# Altium schematic sheet GPS.SchDoc: =title
size A3; DocumentNumber: 8; SheetNumber: 8; SheetTotal: 9
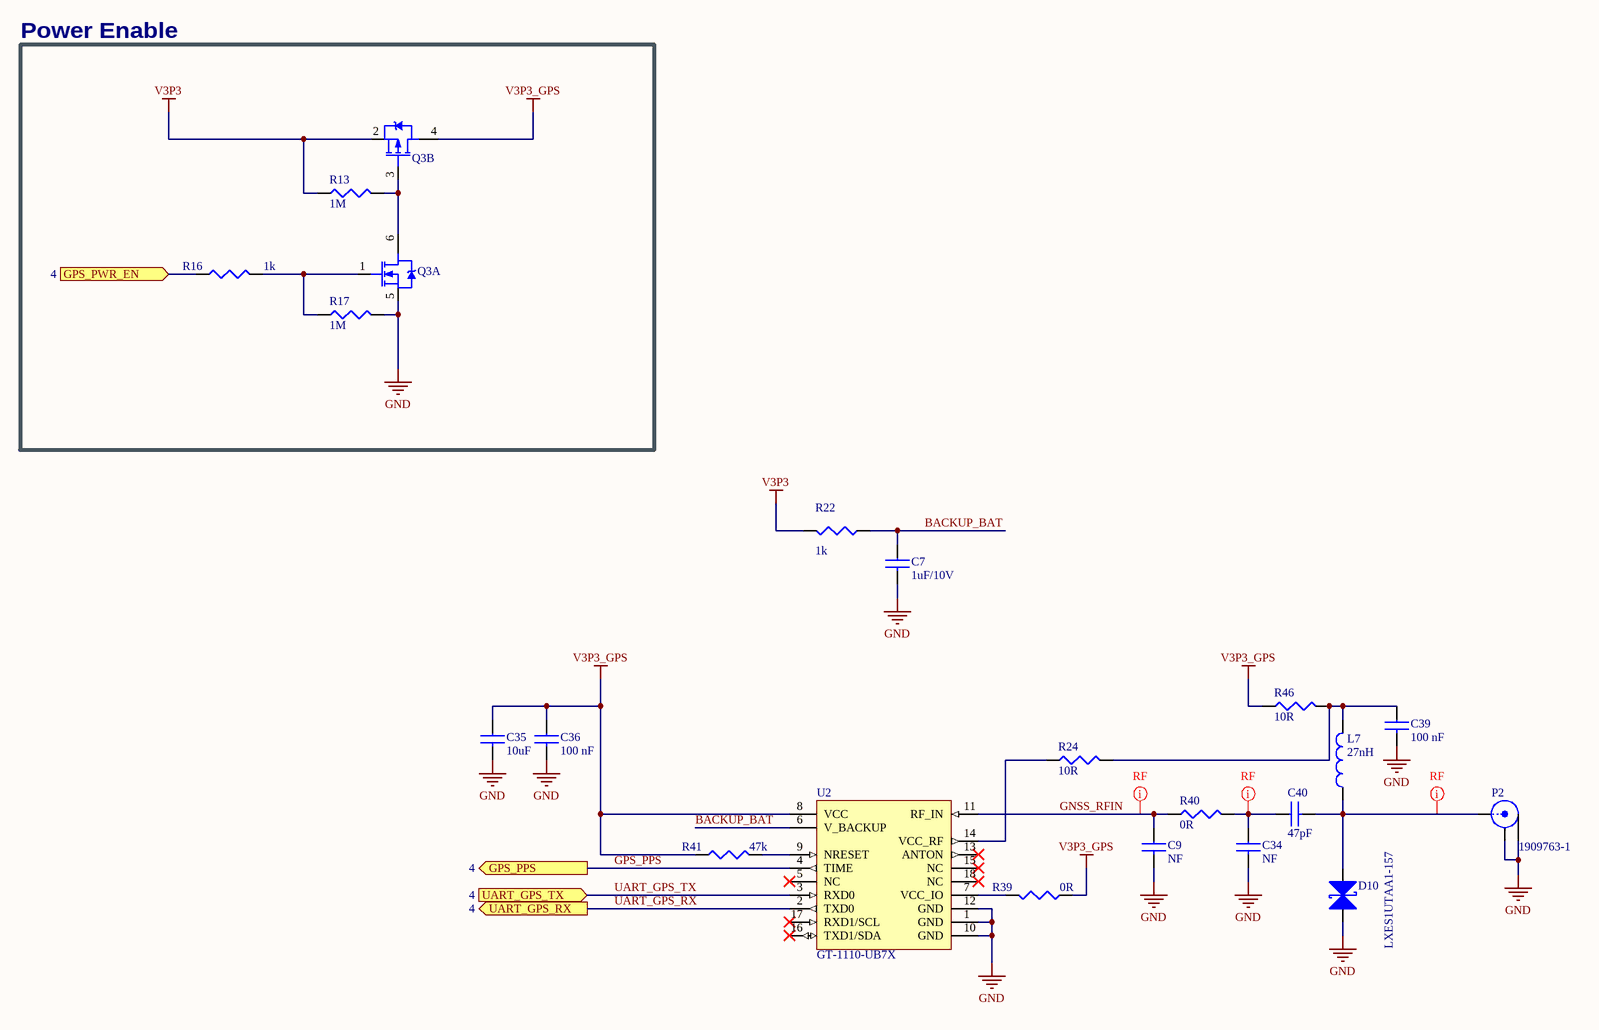
[diagram p0: GPS.SchDoc]

## Parts
C7  1uF/10V  [C0402]
C9  NF  [C0402]
C34  NF  [C0402]
C35  10uF  [C0805]
C36  100 nF  [C0402]
C39  100 nF  [C0402]
C40  47pF  [C0402]
D10  LXES1UTAA1-157  [T0402]
L7  27nH  [L0402]
P2  1909763-1  [CON_U.FL]
Q3  DMC2700UDM-7  [SOT23-6]  (value not drawn)  (parts A,B of 2)
R13  1M  [R0402]
R16  1k  [R0603]
R17  1M  [R0402]
R22  1k  [R0603]
R24  10R  [R0402]
R39  0R  [R0402]
R40  0R  [R0402]
R41  47k  [R0402]
R46  10R  [R0402]
U2  GT-1110-UB7X  [SIM28ML]

## Blocks framed on the sheet
Power Enable: Q3 R13 R16 R17

## Ports
GPS_PPS (out, see 4), GPS_PWR_EN (in, see 4), UART_GPS_RX (out, see 4), UART_GPS_TX (in, see 4)

## Nets
GND: C7.2 C9.2 C34.2 C35.2 C36.2 C39.2 D10.1(K) P2.2(Y) P2.3(GND) Q3.5(S) R17.1 U2.1(GND) U2.10(GND) U2.12(GND)
V3P3: Q3.2(S) R13.2 R22.2
V3P3_GPS: C35.1 C36.1 Q3.4(D) R39.1 R41.1 R46.1 U2.8(VCC)
BACKUP_BAT: C7.1 R22.1 U2.6(V_BACKUP)
GNSS_RFIN: C9.1 R40.1 U2.11(RF_IN)
GPS_PPS: U2.4(TIME) ; port GPS_PPS
GPS_PWR_EN: R16.2 ; port GPS_PWR_EN
UART_GPS_RX: U2.2(TXD0) ; port UART_GPS_RX
UART_GPS_TX: U2.3(RXD0) ; port UART_GPS_TX
NetC34_1: C34.1 C40.1 R40.2
NetC39_1: C39.1 L7.2 R24.2 R46.2
NetC40_2: C40.2 D10.2(A) L7.1 P2.1(X)
NetQ3_1: Q3.1(G) R16.1 R17.2
NetQ3_3: Q3.3(G) Q3.6(D) R13.1
NetR24_1: R24.1 U2.14(VCC_RF)
NetR39_2: R39.2 U2.7(VCC_IO)
NetR41_2: R41.2 U2.9(NRESET)

Not connected (* = marked no-connect by the designer): U2 5(NC)* 13(ANTON)* 15(NC)* 16(TXD1/SDA)* 17(RXD1/SCL)* 18(NC)*

## Layout directives
net class RF: GNSS_RFIN, NetC34_1, NetC40_2

## Notes on the sheet
- Company:
- CONFIDENTAL. Do not distribute.
- Title:
- Size:
- Date:
- A3
- Number:
- Time:
- Variant:
- Revision:
- Sheet
- of
- File:
- Engineer:

## Library data of the parts
C7 = C0402-1uF_10V: CAP, CERM, 1 uF, 10V, +/- 10%, X5R, 0402; CompType: Capacitor; Value: 1uF/10V; Category: Capacitors; Operating Temperature: -55°C ~ 85°C; Package / Case: 0402; RoHS: RoHS Compliant; Temperature Coefficient: X5R; Tolerance: 10%; Voltage - Rated: 10V; MountType: SMT; Technology: Ceramic
C9 C34 = C0402-1.8pF: CAP, CERM, 1.8pF, 50V, +/- 0.1pF, C0G/NP0, 0402; CompType: Capacitor; Category: Capacitors; Operating Temperature: -55°C ~ 125°C; Package / Case: 0402; RoHS: RoHS Compliant; Temperature Coefficient: C0G/NP0; Tolerance: +/- 0.1pF; Voltage - Rated: 50V; MountType: SMT; Technology: Ceramic; Value: NF
C35 = C0805-10uF_16V: CAP, CERM, 10uF, 16V, +/- 20%, X5R, 0805; Manufacturer Part Number: GRM21BR61C106KE15L; CompType: Capacitor; Value: 10uF; Category: Capacitors; Operating Temperature: -55°C ~ 85°C; Package / Case: 0805 (2012 Metric); RoHS: RoHS Compliant; Temperature Coefficient: X5R; Tolerance: 20%; Voltage - Rated: 16 V; MountType: SMT; Technology: Ceramic
C36 C39 = C0402-100nF_50V: CAP, CERM, 100 nF, 50V, +/- 10%, X7R, 0402; Manufacturer Part Number: GRM155R71H104KE14J; CompType: Capacitor; Value: 100 nF; Category: Capacitors; Operating Temperature: -55°C ~ 125°C; Package / Case: 0402; RoHS: RoHS Compliant; Temperature Coefficient: X7R; Tolerance: 10%; Voltage - Rated: 50 V; MountType: SMT; Technology: Ceramic
C40 = C0402-47pF: CAP, CERM, 47pF, 16V, +/- 5%, C0G/NP0, 0402; Manufacturer Part Number: 885012005029; CompType: Capacitor; Category: Capacitors; Operating Temperature: -55°C ~ 125°C; Package / Case: 0402; RoHS: RoHS Compliant; Temperature Coefficient: C0G/NP0; Tolerance: 5%; Voltage - Rated: 16 V; MountType: SMT; Technology: Ceramic; Value: 47pF
D10 = TVSBi_LXES15AAA1-153: TVS DIODE 15 V 0402; Manufacturer: Murata; Type: Zener; Bidirectional Channels: 1; Voltage - Reverse Standoff (Typ): 4V; Power Line Protection: No; Capacitance @ Frequency: 0.05pF @ 1MHz; Supplier 1: Mouser; Manufacturer Part Number: LXES1UTAA1-157; Stock 1: 40283; Pricing 1: 1=0.19, 10=0.105, 50=0.105, 100=0.073, 1000=0.054, 10000=0.042 (USD); Category: Circuit Protection; Family: TVS - Diodes; Series: -; Packaging: Tape & Reel (TR); Unidirectional Channels: -; Voltage - Breakdown (Min): -; Voltage - Clamping (Max) @ Ipp: -; Current - Peak Pulse (10/1000µs): -; Power - Peak Pulse: -; Applications: General Purpose; Operating Temperature: -40°C ~ 85°C (TA); Mounting Type: Surface Mount; Package / Case: 0402 (1005 Metric); Supplier Device Package: 1005; Supplier Part Number 1: 81-LXES15AAA1-153
L7 = LQW15AN27NJ00D: Inductor, Wirewound, 27 nH, 280mA , 520mOhm, SMD; Manufacturer: Murata; Core Material: Air,Ferrite; Tolerance: 5%; DC Resistance (DCR): 520mR; Q Factor: 25; Self Resonant Frequency: 3.5GHz; Shielding: Unshielded; Test Frequency: 100MHz; Supplier 1: Digi-Key; Supplier Part Number 1: 490-1151-1-ND; Manufacturer Part Number: LQW15AN27NJ00D; Stock 1: 111681; Pricing 1: 1=0,17000, 10=0,15500, 100=0,10350, 500=0,08626, 1000=0,07245, 2500=0,06210 (USD); RoHS: Yes; Mount: Surface Mount; Case/Package: 0402; Weight: 2.8E-05oz; Case Code (Metric): 1005; Case Code (Imperial): 0402; Min Operating Temperature: -55°C; Max Operating Temperature: 125°C; Inductance: 27nH; Max DC Current: 280mA; Packaging: Tape and Reel; Package Quantity: 10000; Current Rating: 280mA; Termination: SMD/SMT; Composition: Wirewound; DC Current: 280mA; Military Standard: Not; Length: 1mm; Height: 0.5mm; Width: 0.02inch; Depth: 0.6mm; Radiation Hardening: No; Lead Free: Lead Free; ComponentLink1URL: https://datasheet.ciiva.com/11799/0900766b8090d5c4-11799101.pdf?src-supplier=RSComponents; ComponentLink1Description: https://datasheet.ciiva.com/11799/0900766b8090d5c4-11799101.pdf?src-supplier=RSComponents; ComponentLink2URL: https://datasheet.ciiva.com/17247/l0075s0080lqw15a-00-17247719.pdf?src-supplier=Avnet+Europe; ComponentLink2Description: https://datasheet.ciiva.com/17247/l0075s0080lqw15a-00-17247719.pdf?src-supplier=Avnet+Europe; ComponentLink3URL: https://datasheet.ciiva.com/4977/product-4977130.pdf?src-supplier=Mouser; ComponentLink3Description: https://datasheet.ciiva.com/4977/product-4977130.pdf?src-supplier=Mouser; ComponentLink4URL: https://datasheet.ciiva.com/18088/getdatasheetpartid-55784-18088810.pdf?src-supplier=Verical; ComponentLink4Description: https://datasheet.ciiva.com/18088/getdatasheetpartid-55784-18088810.pdf?src-supplier=Verical; ComponentLink5URL: https://datasheet.ciiva.com/8507/l0075s0080lqw15a-00-8507612.pdf?src-supplier=Avnet; ComponentLink5Description: https://datasheet.ciiva.com/8507/l0075s0080lqw15a-00-8507612.pdf?src-supplier=Avnet; Value: 27nH
P2 = CON_U.FL: CONN UMCC JACK STR 50OHM SMD; Manufacturer: TE Connectivity AMP Connectors; Connector Style: Ultra Miniature Coaxial; Connector Type: Jack, Male Pin; Contact Termination: Solder; Frequency - Max: 6GHz; Includes: 1 pc - 1 Connector; Body Material: Copper Alloy; Body Finish: Gold; Dielectric Material: Liquid Crystal Polymer (LCP); Voltage Rating: 60V; Mating Cycles: 30; Insertion Loss: 0.24dB; .Checked PCB: OK M; Supplier 1: Digi-Key; Manufacturer Part Number: 1909763-1; RoHS: RoHS Compliant; Category: Connectors, Interconnects; Stock 1: 68653; Pricing 1: 1=0.54, 10=0.508, 25=0.4572, 50=0.4066, 100=0.3896, 250=0.35576, 500=0.3388, 1000=0.27951, 2500=0.2541 (USD); Packaging: Cut Tape (CT); Part Status: Active; Shield Termination: Solder; Impedance: 50 Ohm; Mounting Type: Surface Mount; Mounting Feature: -; Cable Group: -; Fastening Type: Snap-On; Features: -; Housing Color: Ivory; Ingress Protection: -; Center Contact Plating: Gold; Operating Temperature: -40°C ~ 90°C; Center Contact Material: Copper Alloy; ComponentLink1URL: http://www.te.com/commerce/DocumentDelivery/DDEController?Action=srchrtrv&DocNm=1909763&DocType=Customer+Drawing&DocLang=English; ComponentLink1Description: http://www.te.com/commerce/DocumentDelivery/DDEController?Action=srchrtrv&DocNm=1909763&DocType=Customer+Drawing&DocLang=English; Supplier Part Number 1: A118077CT-ND; .Checked SCH: OK M
Q3 = Diodes=DMC2700UDM-7: Trans MOSFET N/P-CH 20V 1.34A/1.14A Automotive 6-Pin SOT-26 T/R; Manufacturer: Diodes; Turn-On Delay Time: 5.1ns; Gate to Source Voltage (Vgs): 6V; Rds On Max: 400mR; Input Capacitance: 60.67pF; Continuous Drain Current (ID): 1.14A; Max Power Dissipation: 1.12W; Turn-Off Delay Time: 28.4ns; Number of Elements: 2; Drain to Source Resistance: 1.3R; FET Type: N and P-Channel; Polarity: N-CHANNEL,P-CHANNEL; Supplier 1: Digi-Key; Manufacturer Part Number: DMC2700UDM-7; RoHS: Yes; Category: MOSFETs; Stock 1: 122900; Pricing 1: 1=0.44000, 10=0.32800, 100=0.18590, 500=0.12308, 1000=0.09437 (USD); Mount: Surface Mount; Case/Package: SOT-26; Number of Pins: 6; Min Operating Temperature: -55°C; Max Operating Temperature: 150°C; Package Quantity: 3000; Packaging: Tape and Reel; Drain to Source Voltage (Vdss): 20V; Power Dissipation: 1.12W; Number of Channels: 2; Drain to Source Breakdown Voltage: 20V; Series: -; Length: 3.1mm; Width: 1.7mm; Height: 1.3mm; Radiation Hardening: No; REACH SVHC: No SVHC; Lead Free: Lead Free; RoHS Compliant: Yes; ComponentLink1URL: https://datasheet.ciiva.com/928/dmc2700udm-928784.pdf?src-supplier=Digi-Key; ComponentLink1Description: https://datasheet.ciiva.com/928/dmc2700udm-928784.pdf?src-supplier=Digi-Key; ComponentLink2URL: https://datasheet.ciiva.com/13051/dmc2700udm-73200-13051769.pdf?src-supplier=Mouser; ComponentLink2Description: https://datasheet.ciiva.com/13051/dmc2700udm-73200-13051769.pdf?src-supplier=Mouser; Supplier Part Number 1: DMC2700UDM-7CT-ND
R13 R17 = R0402-1M: RES, 1M, 1%, 1/16 W, 0402; Manufacturer Part Number: RC0402FR-101ML; Power (Watts): 0.063W, 1/16W; .Checked PCB: OK RF; .Checked SCH: RF; Category: Resistors; Package / Case: 0402; Tolerance: ±1%; Value: 1M; RoHS: RoHS Compliant; Composition: Thick Film; Features: -; Size / Dimension: 0.039" L x 0.020" W (1.00mm x 0.50mm); Height: 0.016" (0.40mm); Number of Terminations: 2
R16 = R0603-1k: RES, 1k, 1%, 0.063 W, 0603; Manufacturer Part Number: AC0603FR-101KL; Power (Watts): 0.063W, 1/16W; .Checked PCB: OK RF; .Checked SCH: RF; Category: Resistors; Package / Case: 0603 [1608 Metric]; Tolerance: ±1%; Value: 1k; RoHS: RoHS Compliant; Composition: Thick Film; Features: -; Size / Dimension: 0.063" L x 0.031" W (1.60mm x 0.80mm); Height: 0.016" (0.40mm); Number of Terminations: 2
R22 = R0603-1k: RES, 1k, 1%, 0.063 W, 0603; Power (Watts): 0.063W, 1/16W; .Checked PCB: OK RF; .Checked SCH: RF; RoHS: RoHS Compliant; Package / Case: 0603 [1608 Metric]; Height: 0.016" (0.40mm); Category: Resistors; Tolerance: ±1%; Value: 1k; Composition: Thick Film; Features: -; Size / Dimension: 0.063" L x 0.031" W (1.60mm x 0.80mm); Number of Terminations: 2
R24 R46 = R0402-10R: RES, 10R, 1%, 1/16 W, 0402; Manufacturer Part Number: RC0402FR-0710RP; Power (Watts): 0.063W, 1/16W; .Checked PCB: OK RF; .Checked SCH: RF; Category: Resistors; Package / Case: 0402; Tolerance: ±1%; Value: 10R; RoHS: RoHS Compliant; Composition: Thick Film; Features: -; Size / Dimension: 0.039" L x 0.020" W (1.00mm x 0.50mm); Height: 0.016" (0.40mm); Number of Terminations: 2
R39 R40 = R0402-0R: RES, 0R, 1%, 1/16 W, 0402; Manufacturer Part Number: AC0402FR-070RL; Power (Watts): 0.063W, 1/16W; .Checked PCB: OK RF; .Checked SCH: RF; Category: Resistors; Package / Case: 0402; Tolerance: ±1%; Value: 0R; RoHS: RoHS Compliant; Composition: Thick Film; Features: -; Size / Dimension: 0.039" L x 0.020" W (1.00mm x 0.50mm); Height: 0.016" (0.40mm); Number of Terminations: 2
R41 = R0402-47k: RES, 47k, 1%, 1/16 W, 0402; Manufacturer Part Number: RC0402FR-1347KL; Power (Watts): 0.063W, 1/16W; .Checked PCB: OK RF; .Checked SCH: RF; Value: 47k; Category: Resistors; Package / Case: 0402; Tolerance: ±1%; RoHS: RoHS Compliant; Composition: Thick Film; Features: -; Size / Dimension: 0.039" L x 0.020" W (1.00mm x 0.50mm); Height: 0.016" (0.40mm); Number of Terminations: 2
U2 = GOTOP=GT-1110-UB7X_1: GPS, GLONASS, QZSS and SBAS Module; Manufacturer: GOTOP; Value: GT-1110-UB7X; Manufacturer Part Number: GT-1110-UB7X